# EAGLE schematic water_monitor (EAGLE 9.6.2)
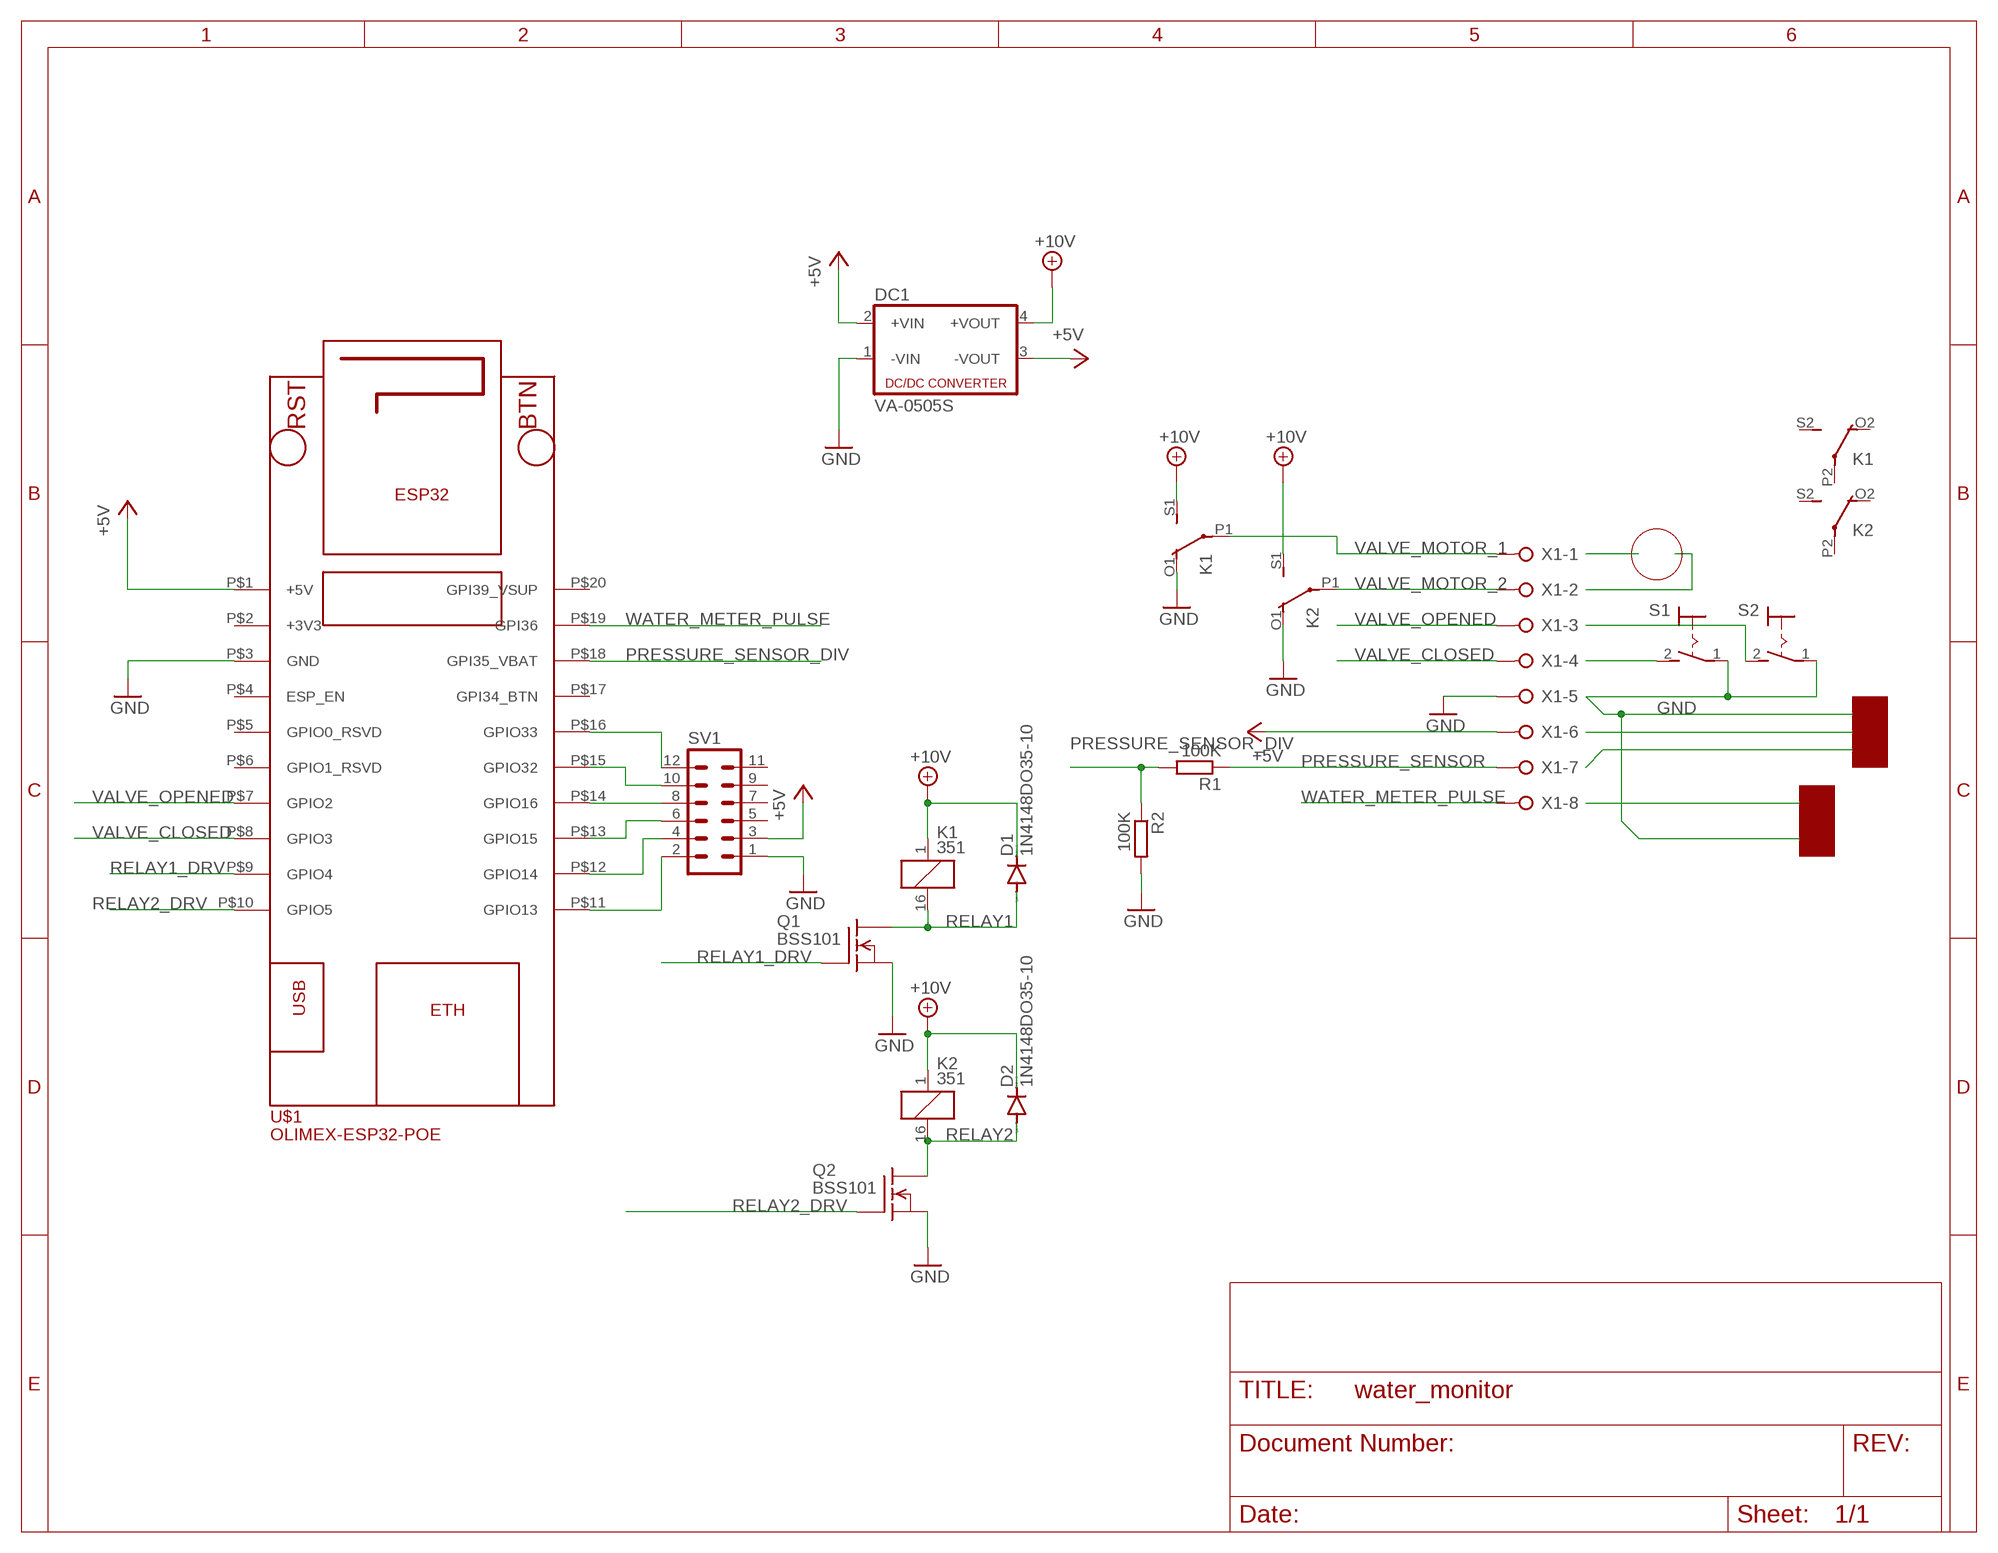
[diagram p0: schematic, sheet 1]

## Parts
D1  1N4148DO35-10  [DO35-10]
D2  1N4148DO35-10  [DO35-10]
DC1  VA-0505S  [4SIL]
K1  351  [351]
K2  351  [351]
Q1  BSS101  [TO92]
Q2  BSS101  [TO92]
R1  100K  R-EU_0207/10  [0207/10]
R2  100K  R-EU_0207/10  [0207/10]
S1  MS243  [MS243]
S2  MS243  [MS243]
SV1  MA06-2  [MA06-2]
U$1  OLIMEX-ESP32-POE  [OLIMEX-ESP32-POE]
X1  W237-08P  [W237-8P]

## Nets
+5V: DC1.2(+VIN) DC1.3(-VOUT) SV1.3 U$1.P$1(+5V) X1.6
+10V: D1.C D2.C DC1.4(+VOUT) K1.1 K1.S1(2:S) K2.1 K2.S1(2:S)
GND: DC1.1(-VIN) K1.O1(2:O) K2.O1(2:O) Q1.1(S) Q2.1(S) R2.2 S1.1(P) S2.1(P) SV1.1 U$1.P$3(GND) X1.5
N$2: S1.2(S)
N$3: S2.2(S)
N$10: SV1.12 U$1.P$16(GPIO33)
N$11: SV1.2 U$1.P$11(GPIO13)
N$12: SV1.4 U$1.P$12(GPIO14)
N$13: SV1.6 U$1.P$13(GPIO15)
N$14: SV1.8 U$1.P$14(GPIO16)
N$15: SV1.10 U$1.P$15(GPIO32)
PRESSURE_SENSOR: R1.1 X1.7
PRESSURE_SENSOR_DIV: R1.2 R2.1 U$1.P$18(GPI35_VBAT)
RELAY1: D1.A K1.16 Q1.3(D)
RELAY1_DRV: Q1.2(G) U$1.P$9(GPIO4)
RELAY2: D2.A K2.16 Q2.3(D)
RELAY2_DRV: Q2.2(G) U$1.P$10(GPIO5)
VALVE_CLOSED: U$1.P$8(GPIO3) X1.4
VALVE_MOTOR_1: K1.P1(2:P) X1.1
VALVE_MOTOR_2: K2.P1(2:P) X1.2
VALVE_OPENED: U$1.P$7(GPIO2) X1.3
WATER_METER_PULSE: U$1.P$19(GPI36) X1.8
Unconnected: K1.O2(3:O) K1.P2(3:P) K1.S2(3:S) K2.O2(3:O) K2.P2(3:P) K2.S2(3:S) SV1.5 SV1.7 SV1.9 SV1.11 U$1.P$2(+3V3) U$1.P$4(ESP_EN) U$1.P$5(GPIO0_RSVD) U$1.P$6(GPIO1_RSVD) U$1.P$17(GPI34_BTN) U$1.P$20(GPI39_VSUP)

## Library data of the parts
D1 D2 = diode:1N4148: DIODE high speed (Philips)
DC1 = dc-dc-converter:VA-*?: DC DC Converter Single Output, 1 Watt Motien Technology Co.,Ltd. Source: Data sheet <http://www.motien.com.tw/data_sheet/VA-1%28H%29.pdf>; OC_FARNELL: unknown; OC_NEWARK: unknown
K1 K2 = relay:351: RELAY 2 x switch, Omron; OC_FARNELL: unknown; OC_NEWARK: unknown
Q1 Q2 = transistor-fet:BSS101: N-Channel Enhancement MOSFET 200V; 0,16A; 11Ohm
R1 R2 = rcl:R-EU_: RESISTOR, European symbol; SPICEPREFIX: R
S1 S2 = switch:MS243: TOGGLE SWITCH
SV1 = con-lstb:MA06-2: PIN HEADER; OC_FARNELL: unknown; OC_NEWARK: unknown
U$1 = olimex_esp32:OLIMEX-ESP32-POE
X1 = con-wago-508:W237-08P: WAGO SREW CLAMP; OC_FARNELL: unknown; OC_NEWARK: unknown